# Altium schematic sheet 01_pmu.SchDoc
size A4; SheetNumber: 1; SheetTotal: 1
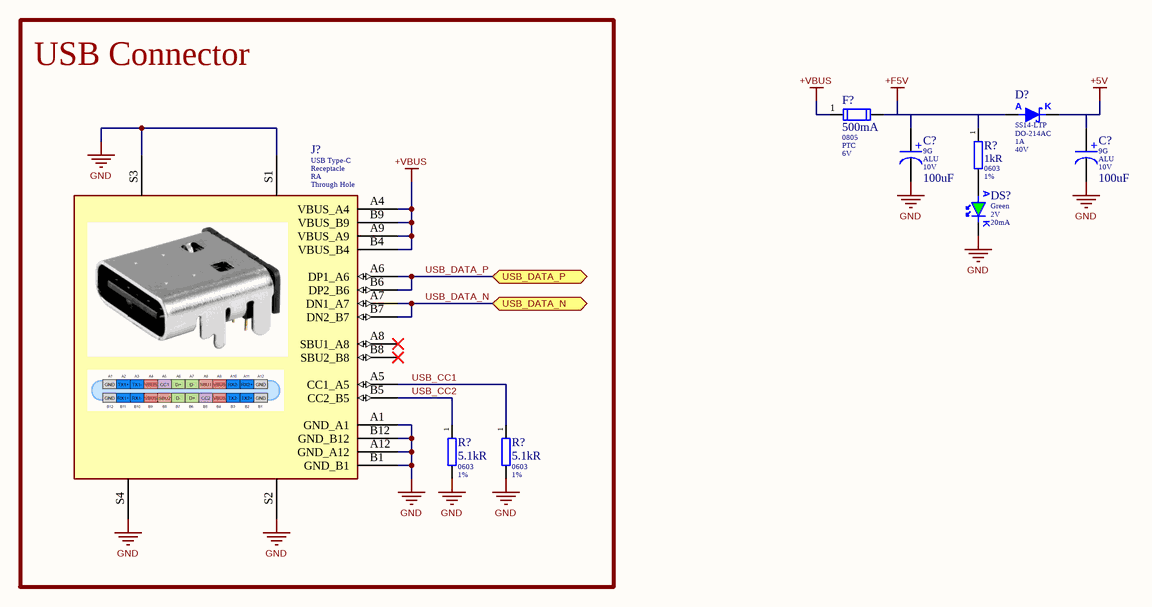
[diagram p0: 01_pmu.SchDoc]

## Parts
(Parts that share a designator on the sheet are numbered #1, #2 ... from top to bottom, then left to right.)
C?#1  _Case Size: 9G  _Type: ALU  Voltage Rating: 10V  Capacitance: 100uF  [CAPAE7866X56M]  (hidden comment: CAP-ALU_100uF_10V_20%_9G/SMD)
C?#2  _Case Size: 9G  _Type: ALU  Voltage Rating: 10V  Capacitance: 100uF  [CAPAE7866X56M]  (hidden comment: CAP-ALU_100uF_10V_20%_9G/SMD)
D?  MFG PN: SS14-LTP  Case/Package: DO-214AC  Average Rectified Current: 1A  Max Reverse Voltage (DC): 40V  [DIOM4327X30N]  (hidden comment: DIO-S_500mV_40V_1A_DO-214AC(SMA))
DS?  Color: Green  Forward Voltage: 2V  Forward Current: 20mA  [LEDC1608X08N_G]  (hidden comment: LED_green_2V_20mA_0603)
F?  Hold Current: 500mA  Case/Package: 0805  _Type: PTC  Voltage Rating: 6V  [FUSC2214X85N]  (hidden comment: FUSE-PTC_500mA_6V_0805_RST)
J?  _Type: USB Type-C  _Mating_type: Receptacle  _Orientation: RA  _Mount: Through Hole  [VALCON_CSP-USC16-TR]  (hidden comment: CON-USBC_receptacle_RA_TH)
R?#1  Resistance: 1kR  Case/Package: 0603  Tolerance: 1%  [RESC1608X06N]  (hidden comment: RES_1K_100mW_1%_0603)
R?#2  Resistance: 5.1kR  Case/Package: 0603  Tolerance: 1%  [RESC1608X06N]  (hidden comment: RES_5.1K_100mW_1%_0603)
R?#3  Resistance: 5.1kR  Case/Package: 0603  Tolerance: 1%  [RESC1608X06N]  (hidden comment: RES_5.1K_100mW_1%_0603)

## Blocks framed on the sheet
USB Connector: J? R?#2 R?#3

## Ports
USB_DATA_N (bidir), USB_DATA_P (bidir)

## Nets
+5V: C?#2.1(Positive) D?.2(K)
+F5V: C?#1.1(Positive) D?.1(A) F?.2 R?#1.1
+VBUS: F?.1 J?.A4(VBUS_A4) J?.A9(VBUS_A9) J?.B4(VBUS_B4) J?.B9(VBUS_B9)
GND: C?#1.2(Negative) C?#2.2(Negative) DS?.2(K) J?.A1(GND_A1) J?.A12(GND_A12) J?.B1(GND_B1) J?.B12(GND_B12) J?.S1(SHELL_GND_S1) J?.S2(SHELL_GND_S2) J?.S3(SHELL_GND_S3) J?.S4(SHELL_GND_S4) R?#2.2 R?#3.2
USB_CC1: J?.A5(CC1_A5) R?#3.1
USB_CC2: J?.B5(CC2_B5) R?#2.1
USB_DATA_N: J?.A7(DN1_A7) J?.B7(DN2_B7) ; port USB_DATA_N
USB_DATA_P: J?.A6(DP1_A6) J?.B6(DP2_B6) ; port USB_DATA_P
NetDS?_1: DS?.1(A) R?#1.2

Not connected (* = marked no-connect by the designer): J? A8(SBU1_A8)* B8(SBU2_B8)*

## Notes on the sheet
- (in symbol Kemet_EDK107M010A9GAA) +

## Library data of the parts
C?#1 C?#2 = Kemet_EDK107M010A9GAA: MFG: KEMET; Tolerance: 20%; Ripple Current: 70mA; Life (Hours): 2000Hour; _Checked_PCB: HoP; Supplier 1: Mouser; MFG PN: EDK107M010A9GAA; RoHS: Yes; Category: Aluminum Electrolytic Capacitors; Stock 1: 3002; Pricing 1: 1=0.36, 10=0.248, 50=0.174, 100=0.149, 1000=0.094, 10000=0.089 (USD); Mount: Surface Mount; Case/Package: Radial; Min Operating Temperature: -40°C; Max Operating Temperature: 85°C; Ripple Current (AC): 70mA; Packaging: Cut Tape; Voltage Rating (DC): 10V; Series: EDK; Diameter: 6.3mm; Height: 5.4mm; Radiation Hardening: No; Reach SVHC Compliant: No; RoHS Compliant: Yes; ComponentLink1URL: https://datasheet.ciiva.com/8032/1680956-8032470.pdf?src-supplier=Element14; ComponentLink1Description: https://datasheet.ciiva.com/8032/1680956-8032470.pdf?src-supplier=Element14; Supplier Part Number 1: 80-EDK107M010A9GAA; _Checked_SCH: HoP; _Creator: HoP; _SYM_REF: CAP-ALU_100uF_10V_20%_9G/SMD
D? = MCC_SS14-LTP: MFG: MCC; Forward Voltage: 500mV; Peak Non-Repetitive Surge Current: 30A; _Checked_PCB: HoP; Supplier 1: Mouser; RoHS: Yes; Category: Uncategorized; Stock 1: 415; Pricing 1: 1=0.26, 10=0.209, 50=0.209, 100=0.111, 1000=0.045, 10000=0.037 (USD); Mount: Surface Mount; Number of Pins: 2; Min Operating Temperature: -55°C; Max Operating Temperature: 150°C; Packaging: Tape and Reel; Series: -; RoHS Compliant: Yes; Lead Free: Lead Free; ComponentLink1URL: http://components.arrow.com/part/dataview/45990919S110376N2022?src-supplier=Arrow+Electronics; ComponentLink1Description: http://components.arrow.com/part/dataview/45990919S110376N2022?src-supplier=Arrow+Electronics; ComponentLink2URL: http://www.mccsemi.com/up_pdf/SS12-L-SS110-L(DO-214AC)-E.pdf?src-supplier=Digi-Key; ComponentLink2Description: http://www.mccsemi.com/up_pdf/SS12-L-SS110-L(DO-214AC)-E.pdf?src-supplier=Digi-Key; ComponentLink3URL: https://www.mccsemi.com/pdf/Products/SS12-L-SS110-L(DO-214AC)-E.pdf?src-supplier=Digi-Key; ComponentLink3Description: https://www.mccsemi.com/pdf/Products/SS12-L-SS110-L(DO-214AC)-E.pdf?src-supplier=Digi-Key; Supplier Part Number 1: 833-SS14-LTP; _Checked_SCH: HoP; _Creator: HoP; _SYM_REF: DIO-S_500mV_40V_1A_DO-214AC(SMA)
DS? = WURTH_150060VS75000: MFG: Wurth Electronics; Lens Color: Colorless; Luminous Intensity: 40mcd; Viewing Angle: 140°; Lens Style: Rectangular,Flat; Dominant Wavelength: 570nm; Lens Transparency: Clear; Power Rating: 72mW; Reverse Voltage (DC): 5V; Lens Size: 0.7mm; _Checked_PCB: HoP; Supplier 1: Mouser; MFG PN: 150060VS75000; RoHS: Yes; Category: LEDs; Stock 1: 314267; Pricing 1: 1=0.15, 10=0.15, 50=0.142, 100=0.122, 1000=0.116, 10000=0.116 (USD); Mount: Surface Mount; Case/Package: 0603; Number of Pins: 2; Case Code (Metric): 1608; Case Code (Imperial): 0603; Weight: 0.000882oz; Min Operating Temperature: -40°C; Max Operating Temperature: 85°C; Package Quantity: 4000; Packaging: Cut Tape; Test Current: 20mA; Illumination Color: Green; Series: WL-SMCW; Length: 1.6mm; Width: 0.8mm; Height: 0.8mm; RoHS Compliant: Yes; ComponentLink1URL: https://datasheet.ciiva.com/29562/150060vs75000-29562919.pdf?src-supplier=Digi-Key; ComponentLink1Description: https://datasheet.ciiva.com/29562/150060vs75000-29562919.pdf?src-supplier=Digi-Key; Supplier Part Number 1: 710-150060VS75000; _Checked_SCH: HoP; _Creator: HoP; _SYM_REF: LED_green_2V_20mA_0603
F? = BOURNS_MF-PSMF050X-2: MFG: Bourns; Max Current Rating: 40A; Resistance: 900mR; Power Dissipation: 500mW; Trip Current: 1A; Time to Trip: 100ms; Approvals: UL; _Checked_PCB: HoP; Supplier 1: Mouser; MFG PN: MF-PSMF050X-2; RoHS: Yes; Category: PTC Resettable Fuses; Stock 1: 26346; Pricing 1: 1=0.33, 10=0.27, 50=0.27, 100=0.204, 1000=0.172, 10000=0.172 (USD); Mount: Surface Mount,PCB; Number of Pins: 2; Case Code (Metric): 2012; Case Code (Imperial): 0805; Terminal Material: Gold; Min Operating Temperature: -40°C; Max Operating Temperature: 85°C; Packaging: Tape and Reel; Operating Supply Voltage: 6V; Package Quantity: 3000; Current Rating: 40A; Termination: SMD/SMT; Max Power Dissipation: 500mW; Voltage Rating (DC): 6V; Series: MF-PSMF; Length: 2.3mm; Width: 1.5mm; Height: 0.85mm; Radiation Hardening: No; Reach SVHC Compliant: No; RoHS Compliant: Yes; ComponentLink1URL: https://datasheet.ciiva.com/3019/mfpsmf-3019799.pdf?src-supplier=Avnet; ComponentLink1Description: https://datasheet.ciiva.com/3019/mfpsmf-3019799.pdf?src-supplier=Avnet; ComponentLink2URL: https://datasheet.ciiva.com/326/mfpsmf-326489.pdf?src-supplier=Digi-Key; ComponentLink2Description: https://datasheet.ciiva.com/326/mfpsmf-326489.pdf?src-supplier=Digi-Key; ComponentLink3URL: https://datasheet.ciiva.com/326/mfpsmf-326490.pdf?src-supplier=Digi-Key; ComponentLink3Description: https://datasheet.ciiva.com/326/mfpsmf-326490.pdf?src-supplier=Digi-Key; ComponentLink4URL: https://datasheet.ciiva.com/326/mfpsmf-326488.pdf?src-supplier=Digi-Key; ComponentLink4Description: https://datasheet.ciiva.com/326/mfpsmf-326488.pdf?src-supplier=Digi-Key; ComponentLink5URL: https://datasheet.ciiva.com/32430/mf-psmf-series-eng-tds-32430651.pdf?src-supplier=Distrelec; ComponentLink5Description: https://datasheet.ciiva.com/32430/mf-psmf-series-eng-tds-32430651.pdf?src-supplier=Distrelec; ComponentLink6URL: https://datasheet.ciiva.com/1274/1442129-1274589.pdf?src-supplier=Element14; ComponentLink6Description: https://datasheet.ciiva.com/1274/1442129-1274589.pdf?src-supplier=Element14; ComponentLink7URL: https://datasheet.ciiva.com/22712/1442129-22712191.pdf?src-supplier=Element14; ComponentLink7Description: https://datasheet.ciiva.com/22712/1442129-22712191.pdf?src-supplier=Element14; ComponentLink8URL: https://datasheet.ciiva.com/22657/1442129-22657847.pdf?src-supplier=Element14; ComponentLink8Description: https://datasheet.ciiva.com/22657/1442129-22657847.pdf?src-supplier=Element14; ComponentLink9URL: https://datasheet.ciiva.com/4501/mfpsmf-69505-4501179.pdf?src-supplier=Mouser; ComponentLink9Description: https://datasheet.ciiva.com/4501/mfpsmf-69505-4501179.pdf?src-supplier=Mouser; Supplier Part Number 1: 652-MF-PSMF050X-2; _Checked_SCH: HoP; _Creator: HoP; _SYM_REF: FUSE-PTC_500mA_6V_0805_RST
J? = Valcon_CSP-USC16-TR: MFG: Valcon; _Checked_PCB: HoP; Package: None; Price: None; Value: *; Purchase-URL: https://pricing.snapeda.com/search/part/CSP-USC16-TR/?ref=eda; SnapEDA_Link: https://www.snapeda.com/parts/CSP-USC16-TR/Valcon/view-part/?ref=snap; Check_prices: https://www.snapeda.com/parts/CSP-USC16-TR/Valcon/view-part/?ref=eda; Availability: In Stock; _Checked_SCH: HoP; _Creator: HoP; MFG PN: CSP-USC16-TR; _SYM_REF: CON-USBC_receptacle_RA_TH
R?#1 = Yageo_RC0603FR-071KL: MFG: Yageo; Temperature Coefficient: 100ppm/°C; Power Rating: 100mW; Voltage Rating: 50V; _Checked_PCB: HoP; _Value: 1000; Supplier 1: Mouser; MFG PN: RC0603FR-071KL; RoHS: Yes; Category: Chip SMD Resistors; Stock 1: 9806849; Pricing 1: 1=0.1, 10=0.019, 50=0.019, 100=0.007, 1000=0.004, 10000=0.002 (USD); Contact Plating: Tin,Matte; Case Code (Imperial): 0603; Case Code (Metric): 1608; Size Code: 0603; Min Operating Temperature: -55°C; Max Operating Temperature: 155°C; Resistor Type: Thick Film; Packaging: Tape and Reel; Termination: SMD/SMT; Features: Moisture Resistant; Series: RC; Max Power Dissipation: 100mW; Number of Terminations: 2; Technology: THICK FILM; Resistance Tolerance: 1%; Construction: Rectangular; Length: 1.6mm; Height: 0.45mm; Depth: 0.8mm; Reach SVHC Compliant: No; Lead Free: Lead Free; Military Standard: Not; RoHS Compliant: Yes; Supplier Part Number 1: 603-RC0603FR-071KL; _Checked_SCH: HoP; _Creator: HoP; _SYM_REF: RES_1K_100mW_1%_0603
R?#2 R?#3 = Yageo_RC0603FR-075K1L: MFG: Yageo; Power Rating: 100mW; Temperature Coefficient: 100ppm/°C; Voltage Rating: 50V; _Checked_PCB: HoP; _Value: 5100; Supplier 1: Mouser; MFG PN: RC0603FR-075K1L; RoHS: Yes; Category: Chip SMD Resistors; Stock 1: 136224; Pricing 1: 1=0.1, 10=0.016, 50=0.016, 100=0.008, 1000=0.004, 10000=0.002 (USD); Number of Pins: 2; Case Code (Imperial): 0603; Case Code (Metric): 1608; Size Code: 0603; Min Operating Temperature: -55°C; Max Operating Temperature: 155°C; Series: RC; Packaging: Tape and Reel; Package Quantity: 1; Termination: SMD/SMT; Resistor Type: Thick Film; Number of Terminations: 2; Max Power Dissipation: 100mW; Voltage Rating (DC): 50V; Features: Moisture Resistant; Resistance Tolerance: 1%; Construction: Rectangular; Length: 0.063inch; Width: 0.031inch; Height: 0.022inch; Depth: 0.8mm; RoHS Compliant: Yes; Reach SVHC Compliant: No; Military Standard: Not; Lead Free: Lead Free; ComponentLink1URL: https://datasheet.ciiva.com/46395/443971-46395016.pdf?src-supplier=Element14; ComponentLink1Description: https://datasheet.ciiva.com/46395/443971-46395016.pdf?src-supplier=Element14; ComponentLink2URL: https://datasheet.ciiva.com/2454/pyu-r-int-thick-7-2454046.pdf?src-supplier=Digi-Key; ComponentLink2Description: https://datasheet.ciiva.com/2454/pyu-r-int-thick-7-2454046.pdf?src-supplier=Digi-Key; ComponentLink3URL: https://datasheet.ciiva.com/2454/pyu-r-int-thick-7-2454047.pdf?src-supplier=Digi-Key; ComponentLink3Description: https://datasheet.ciiva.com/2454/pyu-r-int-thick-7-2454047.pdf?src-supplier=Digi-Key; ComponentLink4URL: https://datasheet.ciiva.com/2454/pyu-r-int-thick-7-2454045.pdf?src-supplier=Digi-Key; ComponentLink4Description: https://datasheet.ciiva.com/2454/pyu-r-int-thick-7-2454045.pdf?src-supplier=Digi-Key; ComponentLink5URL: https://datasheet.ciiva.com/15189/getdatasheetpartid-326732-15189786.pdf?src-supplier=Verical; ComponentLink5Description: https://datasheet.ciiva.com/15189/getdatasheetpartid-326732-15189786.pdf?src-supplier=Verical; Supplier Part Number 1: 603-RC0603FR-075K1L; _Checked_SCH: HoP; _Creator: HoP; _SYM_REF: RES_5.1K_100mW_1%_0603